# Altium schematic sheet sensorbox_1.SchDoc
size A4
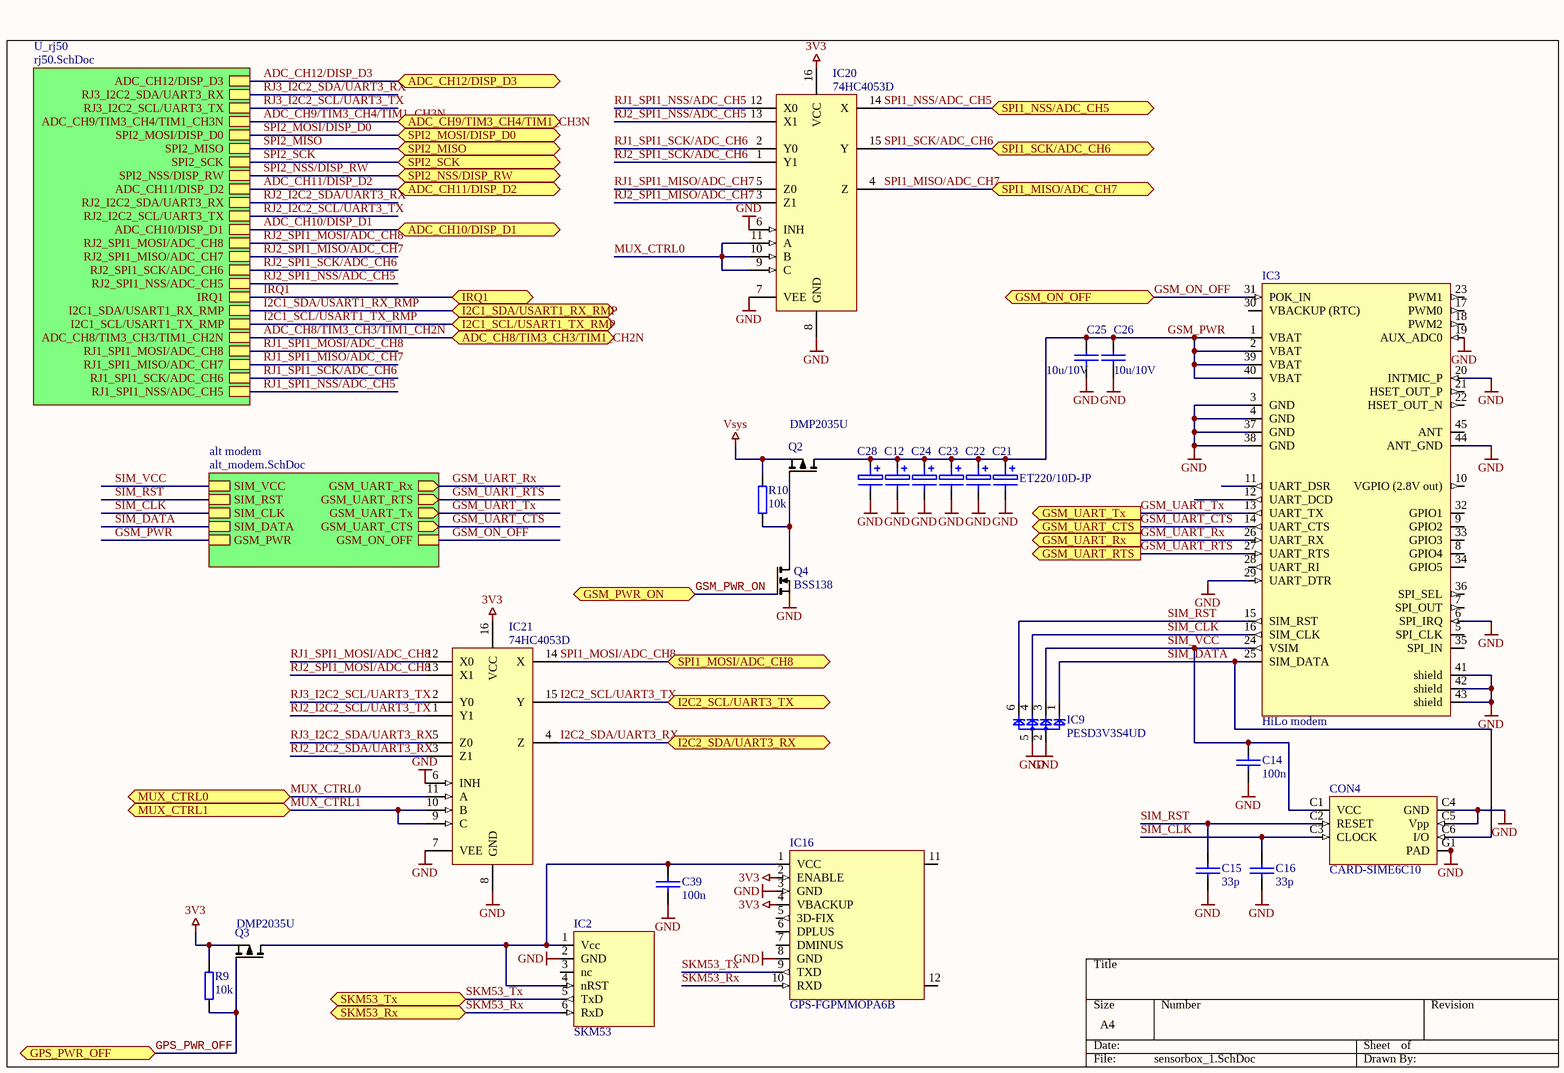
[diagram p0: sensorbox_1.SchDoc]

## Parts
C12  ET220/10D-JP  [2917_SMDD]
C14  100n  [0603C]
C15  33p  [0603C]
C16  33p  [0603C]
C21  ET220/10D-JP  [2917_SMDD]  (value not drawn)
C22  ET220/10D-JP  [2917_SMDD]  (value not drawn)
C23  ET220/10D-JP  [2917_SMDD]  (value not drawn)
C24  ET220/10D-JP  [2917_SMDD]  (value not drawn)
C25  10u/10V  [0805C]
C26  10u/10V  [0805C]
C28  ET220/10D-JP  [2917_SMDD]  (value not drawn)
C39  100n  [0603C]
CON4  CARD-SIME6C10  [CON_CARD-SIME6C10]
IC2  SKM53  [RF_GPS_SKM53]
IC3  HiLo modem  [MOLEX_54102-0403]
IC9  PESD3V3S4UD  [SOT23-6]
IC16  GPS-FGPMMOPA6B  [GPS-FGPMMOPA6B]
IC20  74HC4053D  [SO-16]
IC21  74HC4053D  [SO-16]
Q2  DMP2035U  [sot-23]
Q3  DMP2035U  [sot-23]
Q4  BSS138  [SOT-23]
R9  10k  [0603R]
R10  10k  [0603R]

## Sub-sheets
alt modem = alt_modem.SchDoc: GSM_UART_Rx (out), GSM_UART_RTS (out), GSM_UART_Tx (out), GSM_UART_CTS (out), SIM_VCC, SIM_RST, SIM_CLK, SIM_DATA, GSM_PWR, GSM_ON_OFF
U_rj50 = rj50.SchDoc: RJ1_SPI1_NSS/ADC_CH5, RJ1_SPI1_SCK/ADC_CH6, RJ1_SPI1_MISO/ADC_CH7, RJ1_SPI1_MOSI/ADC_CH8, ADC_CH8/TIM3_CH3/TIM1_CH2N, I2C1_SCL/USART1_TX_RMP, I2C1_SDA/USART1_RX_RMP, IRQ1, RJ2_SPI1_NSS/ADC_CH5, RJ2_SPI1_SCK/ADC_CH6, RJ2_SPI1_MISO/ADC_CH7, RJ2_SPI1_MOSI/ADC_CH8, ADC_CH10/DISP_D1, RJ2_I2C2_SCL/UART3_TX, RJ2_I2C2_SDA/UART3_RX, ADC_CH11/DISP_D2, SPI2_NSS/DISP_RW, SPI2_SCK, SPI2_MISO, SPI2_MOSI/DISP_D0, ADC_CH9/TIM3_CH4/TIM1_CH3N, RJ3_I2C2_SCL/UART3_TX, RJ3_I2C2_SDA/UART3_RX, ADC_CH12/DISP_D3

## Ports
ADC_CH8/TIM3_CH3/TIM1_CH2N, ADC_CH9/TIM3_CH4/TIM1_CH3N, ADC_CH10/DISP_D1, ADC_CH11/DISP_D2, ADC_CH12/DISP_D3, GPS_PWR_OFF, GSM_ON_OFF, GSM_PWR_ON, GSM_UART_CTS (out), GSM_UART_RTS (out), GSM_UART_Rx (out), GSM_UART_Tx (out), I2C1_SCL/USART1_TX_RMP, I2C1_SDA/USART1_RX_RMP, I2C2_SCL/UART3_TX, I2C2_SDA/UART3_RX, IRQ1, MUX_CTRL0, MUX_CTRL1, SKM53_Rx, SKM53_Tx, SPI1_MISO/ADC_CH7, SPI1_MOSI/ADC_CH8, SPI1_NSS/ADC_CH5, SPI1_SCK/ADC_CH6, SPI2_MISO, SPI2_MOSI/DISP_D0, SPI2_NSS/DISP_RW, SPI2_SCK

## Nets
3V3: IC16.2(ENABLE) IC16.4(VBACKUP) IC20.16(VCC) IC21.16(VCC) Q3.2(S) R9.2
GND: C12.2 C14.2 C15.2 C16.2 C21.2 C22.2 C23.2 C24.2 C25.1 C26.2 C28.2 C39.2 CON4.C4(GND) CON4.C5(Vpp) CON4.G1(PAD) CON4.G2(GND) CON4.G3(GND) CON4.G4(GND) IC2.2(GND) IC3.3(GND) IC3.4(GND) IC3.6(SPI_IRQ) IC3.19(AUX_ADC0) IC3.20(INTMIC_P) IC3.29(UART_DTR) IC3.37(GND) IC3.38(GND) IC3.41(shield) IC3.42(shield) IC3.43(shield) IC3.44(ANT_GND) IC9.2 IC9.5 IC16.3(GND) IC16.8(GND) IC20.6(INH) IC20.7(VEE) IC20.8(GND) IC21.6(INH) IC21.7(VEE) IC21.8(GND) Q4.2(S)
Vsys: Q2.2(S) R10.2
ADC_CH8/TIM3_CH3/TIM1_CH2N: port ADC_CH8/TIM3_CH3/TIM1_CH2N, sheet U_rj50/ADC_CH8/TIM3_CH3/TIM1_CH2N
ADC_CH9/TIM3_CH4/TIM1_CH3N: port ADC_CH9/TIM3_CH4/TIM1_CH3N, sheet U_rj50/ADC_CH9/TIM3_CH4/TIM1_CH3N
ADC_CH10/DISP_D1: port ADC_CH10/DISP_D1, sheet U_rj50/ADC_CH10/DISP_D1
ADC_CH11/DISP_D2: port ADC_CH11/DISP_D2, sheet U_rj50/ADC_CH11/DISP_D2
ADC_CH12/DISP_D3: port ADC_CH12/DISP_D3, sheet U_rj50/ADC_CH12/DISP_D3
GPS_PWR_OFF: Q3.1(G) R9.1 ; port GPS_PWR_OFF
GSM_ON_OFF: IC3.31(POK_IN) ; port GSM_ON_OFF, sheet alt modem/GSM_ON_OFF
GSM_PWR: C12.1 C21.1 C22.1 C23.1 C24.1 C25.2 C26.1 C28.1 IC3.1(VBAT) IC3.2(VBAT) IC3.39(VBAT) IC3.40(VBAT) Q2.3(D) ; sheet alt modem/GSM_PWR
GSM_PWR_ON: Q4.1(G) ; port GSM_PWR_ON
GSM_UART_CTS: IC3.14(UART_CTS) ; port GSM_UART_CTS, sheet alt modem/GSM_UART_CTS
GSM_UART_RTS: IC3.27(UART_RTS) ; port GSM_UART_RTS, sheet alt modem/GSM_UART_RTS
GSM_UART_Rx: IC3.26(UART_RX) ; port GSM_UART_Rx, sheet alt modem/GSM_UART_Rx
GSM_UART_Tx: IC3.13(UART_TX) ; port GSM_UART_Tx, sheet alt modem/GSM_UART_Tx
I2C1_SCL/USART1_TX_RMP: port I2C1_SCL/USART1_TX_RMP, sheet U_rj50/I2C1_SCL/USART1_TX_RMP
I2C1_SDA/USART1_RX_RMP: port I2C1_SDA/USART1_RX_RMP, sheet U_rj50/I2C1_SDA/USART1_RX_RMP
I2C2_SCL/UART3_TX: IC21.15(Y) ; port I2C2_SCL/UART3_TX
I2C2_SDA/UART3_RX: IC21.4(Z) ; port I2C2_SDA/UART3_RX
IRQ1: port IRQ1, sheet U_rj50/IRQ1
MUX_CTRL0: IC20.9(C) IC20.10(B) IC20.11(A) IC21.11(A) ; port MUX_CTRL0
MUX_CTRL1: IC21.9(C) IC21.10(B) ; port MUX_CTRL1
RJ1_SPI1_MISO/ADC_CH7: IC20.5(Z0) ; sheet U_rj50/RJ1_SPI1_MISO/ADC_CH7
RJ1_SPI1_MOSI/ADC_CH8: IC21.12(X0) ; sheet U_rj50/RJ1_SPI1_MOSI/ADC_CH8
RJ1_SPI1_NSS/ADC_CH5: IC20.12(X0) ; sheet U_rj50/RJ1_SPI1_NSS/ADC_CH5
RJ1_SPI1_SCK/ADC_CH6: IC20.2(Y0) ; sheet U_rj50/RJ1_SPI1_SCK/ADC_CH6
RJ2_I2C2_SCL/UART3_TX: IC21.1(Y1) ; sheet U_rj50/RJ2_I2C2_SCL/UART3_TX
RJ2_I2C2_SDA/UART3_RX: IC21.3(Z1) ; sheet U_rj50/RJ2_I2C2_SDA/UART3_RX
RJ2_SPI1_MISO/ADC_CH7: IC20.3(Z1) ; sheet U_rj50/RJ2_SPI1_MISO/ADC_CH7
RJ2_SPI1_MOSI/ADC_CH8: IC21.13(X1) ; sheet U_rj50/RJ2_SPI1_MOSI/ADC_CH8
RJ2_SPI1_NSS/ADC_CH5: IC20.13(X1) ; sheet U_rj50/RJ2_SPI1_NSS/ADC_CH5
RJ2_SPI1_SCK/ADC_CH6: IC20.1(Y1) ; sheet U_rj50/RJ2_SPI1_SCK/ADC_CH6
RJ3_I2C2_SCL/UART3_TX: IC21.2(Y0) ; sheet U_rj50/RJ3_I2C2_SCL/UART3_TX
RJ3_I2C2_SDA/UART3_RX: IC21.5(Z0) ; sheet U_rj50/RJ3_I2C2_SDA/UART3_RX
SIM_CLK: C16.1 CON4.C3(CLOCK) IC3.16(SIM_CLK) IC9.4 ; sheet alt modem/SIM_CLK
SIM_DATA: CON4.C6(I/O) IC3.25(SIM_DATA) IC9.1 ; sheet alt modem/SIM_DATA
SIM_RST: C15.1 CON4.C2(RESET) IC3.15(SIM_RST) IC9.6 ; sheet alt modem/SIM_RST
SIM_VCC: C14.1 CON4.C1(VCC) IC3.24(VSIM) IC9.3 ; sheet alt modem/SIM_VCC
SKM53_Rx: IC2.6(RxD) IC16.10(RXD) ; port SKM53_Rx
SKM53_Tx: IC2.5(TxD) IC16.9(TXD) ; port SKM53_Tx
SPI1_MISO/ADC_CH7: IC20.4(Z) ; port SPI1_MISO/ADC_CH7
SPI1_MOSI/ADC_CH8: IC21.14(X) ; port SPI1_MOSI/ADC_CH8
SPI1_NSS/ADC_CH5: IC20.14(X) ; port SPI1_NSS/ADC_CH5
SPI1_SCK/ADC_CH6: IC20.15(Y) ; port SPI1_SCK/ADC_CH6
SPI2_MISO: port SPI2_MISO, sheet U_rj50/SPI2_MISO
SPI2_MOSI/DISP_D0: port SPI2_MOSI/DISP_D0, sheet U_rj50/SPI2_MOSI/DISP_D0
SPI2_NSS/DISP_RW: port SPI2_NSS/DISP_RW, sheet U_rj50/SPI2_NSS/DISP_RW
SPI2_SCK: port SPI2_SCK, sheet U_rj50/SPI2_SCK
NetC39_1: C39.1 IC2.1(Vcc) IC2.4(nRST) IC16.1(VCC) Q3.3(D)
NetQ2_1: Q2.1(G) Q4.3(D) R10.1

Not connected (* = marked no-connect by the designer): IC2 3(nc); IC3 5(SPI_CLK) 7(SPI_OUT) 8(GPIO4) 9(GPIO2) 10(VGPIO_(2.8V_out)) 11(UART_DSR) 12(UART_DCD) 17(PWM0) 18(PWM2) 21(HSET_OUT_P) 22(HSET_OUT_N) 23(PWM1) 28(UART_RI) 30(VBACKUP_(RTC)) 32(GPIO1) 33(GPIO3) 34(GPIO5) 35(SPI_IN) 36(SPI_SEL) 45(ANT); IC16 5(3D-FIX) 6(DPLUS) 7(DMINUS) 11 12

## Library data of the parts
C12 C21-C24 C28 = CAP_TANT_SMDD: Tantalium Capacitor
C14-C16 C39 = CAP_general: Capacitor
C25 C26 = CAP_SMD_0805: Capacitor SMD
CON4 = CON_CARD-SIME6C10: Sim Card Holder (Maritex)
IC2 = RF_GPS_SKM53: GPS receiver
IC3 = RF_GSM_Hilo (Sagem): GPRS/EDGE modem (Sagem)
IC9 = D_TVS_BZA462A: Quadruple 4V ESD transient voltage suppressor
IC16 = RF_GPS_FGPMMOPA6B: GPS receiver (Maritex)
IC20 IC21 = 4053
Q2 Q3 = Q_BSS84: P MOSFET 50V, 0.36W, 0.15A
Q4 = Q_BSS138
R9 R10 = RES_0603: SMD Resistor